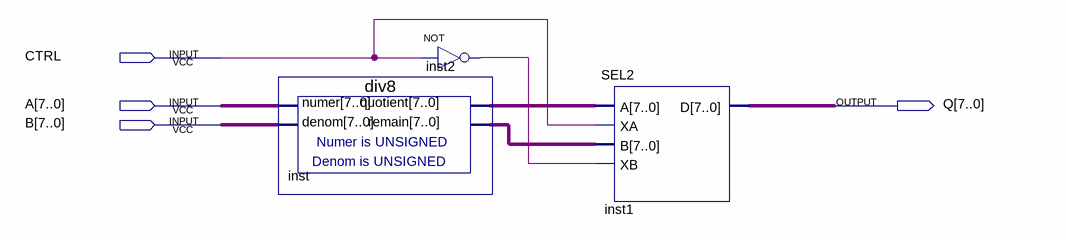
[diagram p0: schematic sheet]
// Quartus schematic DIV.bdf as structural Verilog: 3 symbols, 4 pins
module DIV (
  input  CTRL,
  input  [7:0] A,
  input  [7:0] B,
  output [7:0] Q
);

  wire inst2_out;
  wire [7:0] inst_quotient, inst_remain;

  div8 inst (.numer(A), .denom(B), .quotient(inst_quotient), .remain(inst_remain));
  not inst2 (inst2_out, CTRL);
  SEL2 inst1 (.A(inst_quotient), .XA(CTRL), .B(inst_remain), .XB(inst2_out), .D(Q));
endmodule
